# Altium schematic sheet 555_SCHEMATIC.SchDoc
size A

## Parts
(Parts that share a designator on the sheet are numbered #1, #2 ... from top to bottom, then left to right.)
U?#1  NE555S-13  [SOIC8]
U?#2  NE555S-13  [SOIC8]
U?#3  NE555S-13  [SOIC8]
U?#4  NE555S-13  [SOIC8]
U?#5  NE555S-13  [SOIC8]
U?#6  NE555S-13  [SOIC8]

## Nets
NetU?#4_1: U?#4.1(GND) U?#5.1(GND) U?#6.1(GND)
NetU?#4_2: U?#4.2(TRIG) U?#5.2(TRIG) U?#6.2(TRIG)
NetU?#4_3: U?#4.3(OUT) U?#5.3(OUT) U?#6.3(OUT)
NetU?#4_4: U?#4.4(RESET) U?#5.4(RESET) U?#6.4(RESET)
NetU?#4_5: U?#4.5(CONT) U?#5.5(CONT) U?#6.5(CONT)
NetU?#4_6: U?#4.6(THRES) U?#5.6(THRES) U?#6.6(THRES)
NetU?#4_7: U?#4.7(DISCH) U?#5.7(DISCH) U?#6.7(DISCH)
NetU?#4_8: U?#4.8(Vcc) U?#5.8(Vcc) U?#6.8(Vcc)

Not connected (* = marked no-connect by the designer): U?#1 1(GND) 2(TRIG) 3(OUT) 4(RESET) 5(CONT) 6(THRES) 7(DISCH) 8(Vcc); U?#2 1(GND) 2(TRIG) 3(OUT) 4(RESET) 5(CONT) 6(THRES) 7(DISCH) 8(Vcc); U?#3 1(GND) 2(TRIG) 3(OUT) 4(RESET) 5(CONT) 6(THRES) 7(DISCH) 8(Vcc)

## Library data of the parts
U?#1-U?#6 = NE555S-13: 555 Type, Timer/Oscillator (Single) IC 500kHz 8-SOIC (0.154", 3.90mm Width); Manufacturer: Diodes; Max Supply Voltage: 16V; Min Supply Voltage: 4.5V; Operating Supply Current: 13mA; High Level Output Current: -200mA; Low Level Output Current: 200mA; Quiescent Current: 15mA; Number of Timers/Counters: 1; Supplier 1: Digi-Key; Manufacturer Part Number: NE555S-13; Stock 1: 3594; Pricing 1: 1=0.37, 10=0.303, 100=0.206, 500=0.15452, 1000=0.11588 (USD); Mount: Surface Mount; Case/Package: SO; Number of Pins: 8; Weight: 0.01787oz; Contact Plating: Matte,Tin; Min Operating Temperature: 0°C; Max Operating Temperature: 70°C; Packaging: Tape and Reel; Package Quantity: 2500; Frequency: 500kHz; Length: 4.95mm; Height: 1.5mm; Width: 3.95mm; Radiation Hardening: No; Lead Free: Lead Free; REACH SVHC: No SVHC; ComponentLink1URL: https://www.diodes.com/assets/Datasheets/NE555_SA555_NA555.pdf; ComponentLink1Description: https://www.diodes.com/assets/Datasheets/NE555_SA555_NA555.pdf; Supplier Part Number 1: NE555S-13DIDKR-ND